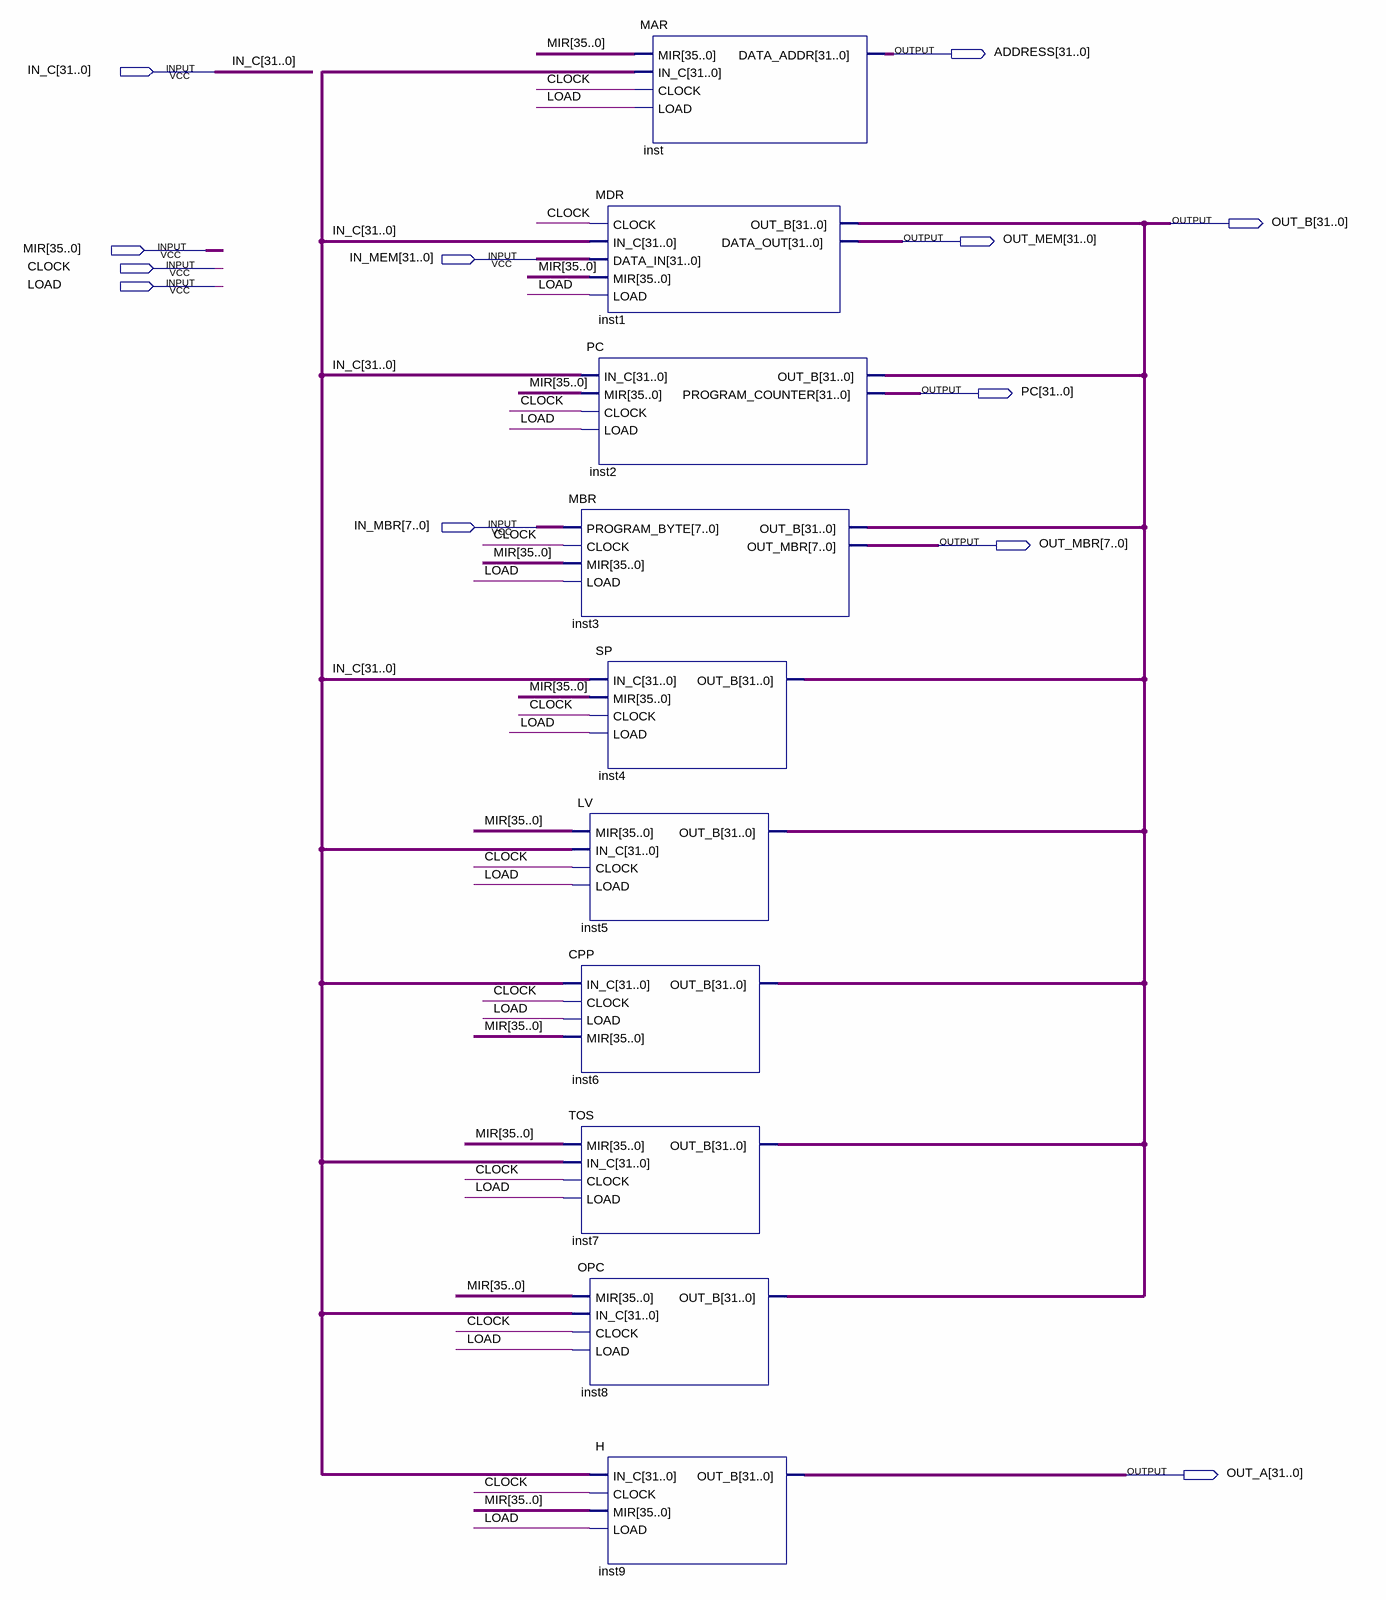
[diagram p0: schematic sheet]
// Quartus schematic REGISTER_BANK2.bdf as structural Verilog: 10 symbols, 12 pins
module REGISTER_BANK2 (
  input  [31:0] IN_C,
  input  [35:0] MIR,
  input  [31:0] IN_MEM,
  input  CLOCK,
  input  LOAD,
  input  [7:0] IN_MBR,
  output [31:0] ADDRESS,
  output [31:0] OUT_B,
  output [31:0] OUT_MEM,
  output [31:0] PC,
  output [7:0] OUT_MBR,
  output [31:0] OUT_A
);

  MDR inst1 (.CLOCK(CLOCK), .IN_C(IN_C), .DATA_IN(IN_MEM), .MIR(MIR), .LOAD(LOAD), .OUT_B(OUT_B), .DATA_OUT(OUT_MEM));
  PC inst2 (.IN_C(IN_C), .MIR(MIR), .CLOCK(CLOCK), .LOAD(LOAD), .OUT_B(OUT_B), .PROGRAM_COUNTER(PC));
  MBR inst3 (.PROGRAM_BYTE(IN_MBR), .CLOCK(CLOCK), .MIR(MIR), .LOAD(LOAD), .OUT_B(OUT_B), .OUT_MBR(OUT_MBR));
  SP inst4 (.IN_C(IN_C), .MIR(MIR), .CLOCK(CLOCK), .LOAD(LOAD), .OUT_B(OUT_B));
  LV inst5 (.MIR(MIR), .IN_C(IN_C), .CLOCK(CLOCK), .LOAD(LOAD), .OUT_B(OUT_B));
  CPP inst6 (.IN_C(IN_C), .CLOCK(CLOCK), .LOAD(LOAD), .MIR(MIR), .OUT_B(OUT_B));
  TOS inst7 (.MIR(MIR), .IN_C(IN_C), .CLOCK(CLOCK), .LOAD(LOAD), .OUT_B(OUT_B));
  OPC inst8 (.MIR(MIR), .IN_C(IN_C), .CLOCK(CLOCK), .LOAD(LOAD), .OUT_B(OUT_B));
  H inst9 (.IN_C(IN_C), .CLOCK(CLOCK), .MIR(MIR), .LOAD(LOAD), .OUT_B(OUT_A));
  MAR inst (.MIR(MIR), .IN_C(IN_C), .CLOCK(CLOCK), .LOAD(LOAD), .DATA_ADDR(ADDRESS));
endmodule
